# EAGLE design 5V AC TO DC (EAGLE 9.6.2)
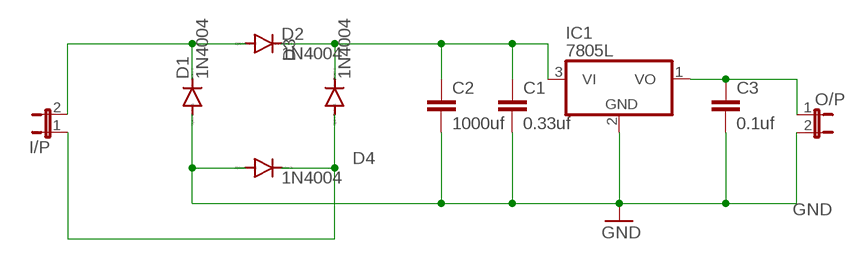
[diagram p0: schematic, sheet 1]

## Parts
C1  0.33uf  C2,5-3  [C2.5-3]
C2  1000uf  C2,5-3  [C2.5-3]
C3  0.1uf  C2,5-3  [C2.5-3]
D1  1N4004  [DO41-10]
D2  1N4004  [DO41-10]
D3  1N4004  [DO41-10]
D4  1N4004  [DO41-10]
I/P  JP1E  [JP1]
IC1  7805L  [TO92]
O/P  JP1E  [JP1]

## Nets
GND: C1.2 C2.2 C3.2 D1.A D4.A IC1.2(GND) O/P.2
N$1: D1.C D2.A I/P.2
N$2: C1.1 C2.1 D2.C D3.C IC1.3(VI)
N$3: C3.1 IC1.1(VO) O/P.1
N$5: D3.A D4.C I/P.1

## Library data of the parts
C1-C3 = capacitor-wima:C: CAPACITOR naming: grid - package width
D1-D4 = diode:1N4004: DIODE general purpose rectifier, 1 A
I/P O/P = jumper:JP1E: JUMPER
IC1 = linear:78*: Positive VOLTAGE REGULATOR Source: http://cache.national.com/ds/LM/LM78L05.pdf http://www.fairchildsemi.com/ds/LM/LM7805.pdf

## Board
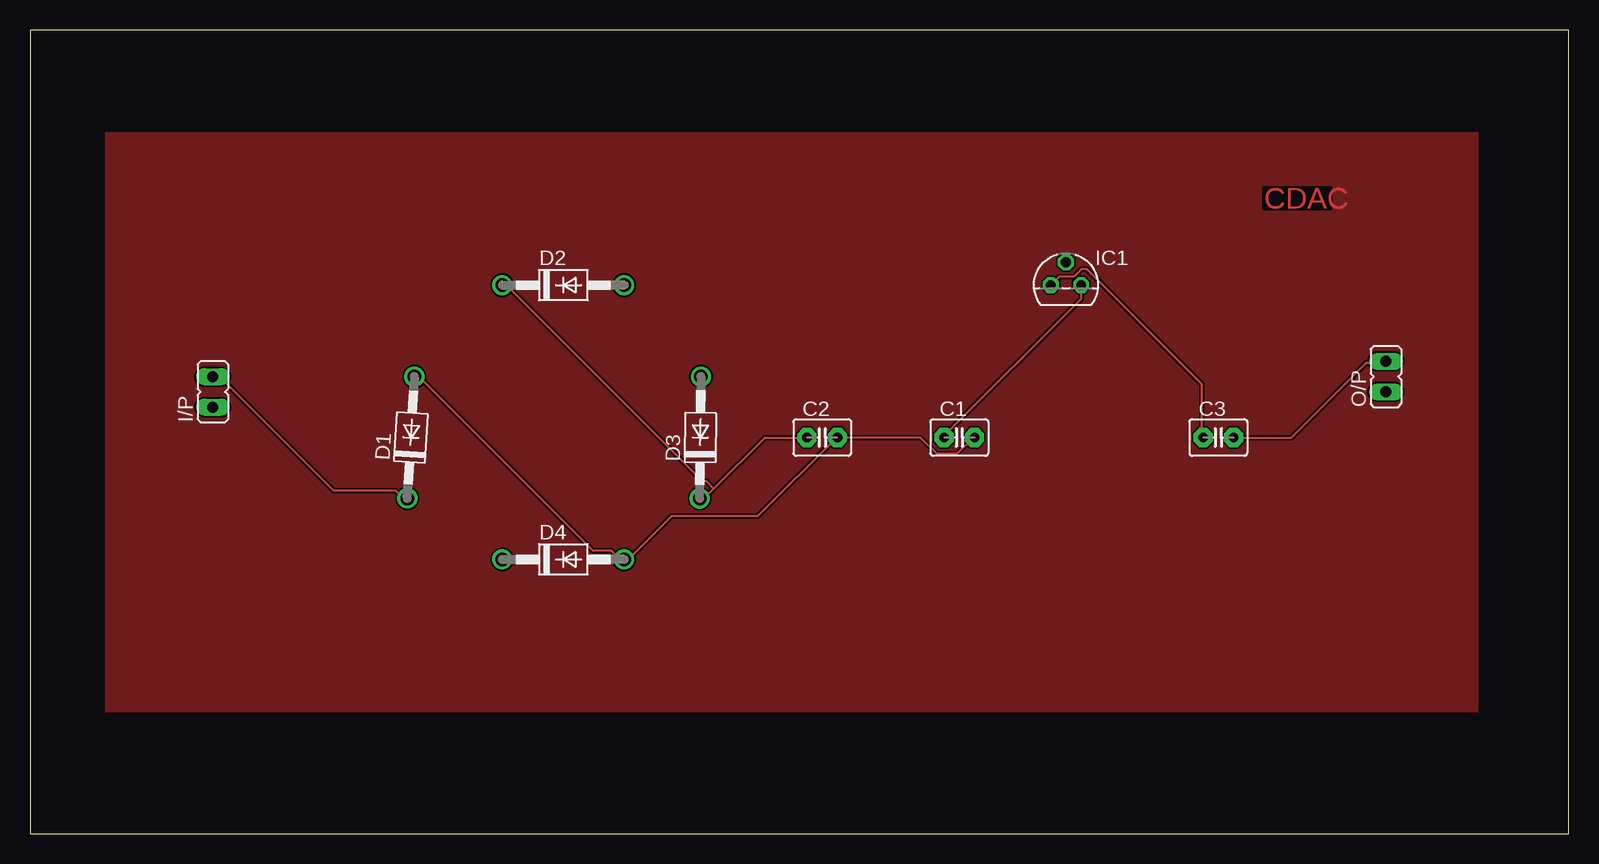
[diagram p1: board, top side]
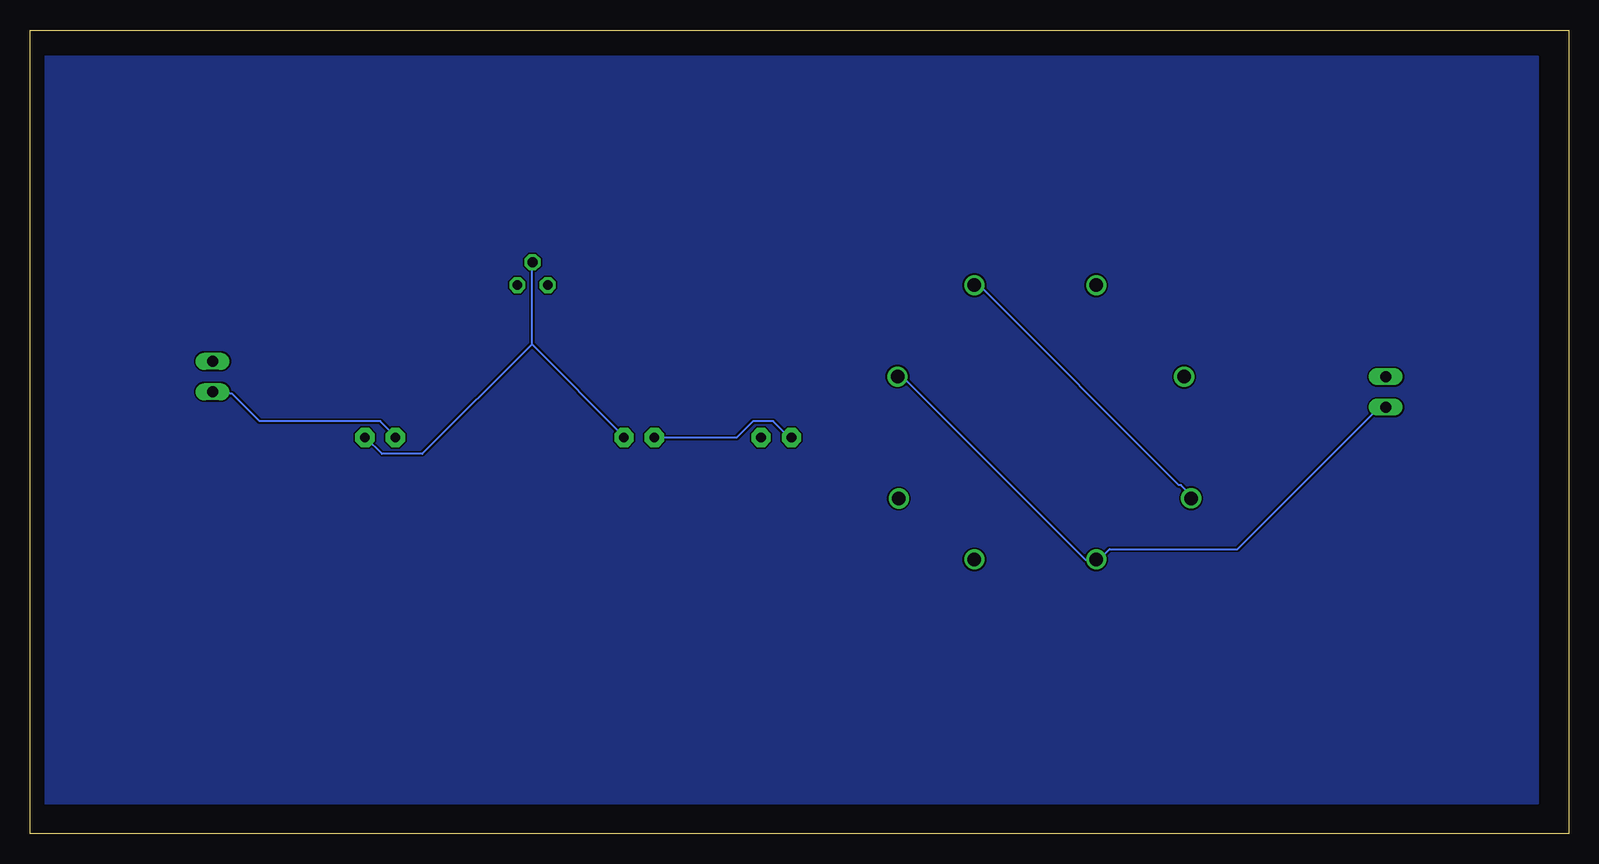
[diagram p2: board, bottom side, seen from below]

Size 128.25 x 66.98 mm. Coordinates in mm from the lower left corner, seen from the top.
Outline: 0,0 128.25,0 128.25,66.98 0,66.98 0,0
Copper layers (1*16): Top 0.035mm / dielectric 1.5mm / Bottom 0.035mm
Design rules "default": minimum track width 6mil, minimum drill 0.35mm, track to track 6mil, track to pad 6mil, pad to pad 6mil, via to via 6mil, smd to smd 6mil, copper to edge 40mil, drill to drill 6mil, minimum pad ring 10mil, minimum via ring 8mil, stop-mask expansion 4mil, vias tented up to drill 0mil, thermal gap 10mil

### Footprints (pad centres in the part's own frame; a part is rotated, then mirrored left to right if it is on the bottom)
C2.5-3 = drill 0.813 pad 1.6 octagon: 1 -1.27,0; 2 1.27,0
DO41-10 = drill 1.118: A 5.08,0; C -5.08,0
JP1 = drill 0.914 long: 1 0,-1.27; 2 0,1.27
TO92 = drill 0.813 octagon: 1 -1.27,0; 2 0,1.905; 3 1.27,0

### Placement (x,y rotation side)
C1  77.47,33.02 0 top
C2  66.04,33.02 0 top
C3  99.06,33.02 0 top
D1  31.75,33.02 86.7 top
D2  44.45,45.72 0 top
D3  55.88,33.02 89.4 top
D4  44.45,22.86 0 top
I/P  15.24,36.83 0 top
IC1  86.36,45.72 0 top
O/P  113.03,38.1 0 top

### Tracks (layer width: path | path; a pad name or v marks a point on that pad's centre or on a via)
BOTTOM
  pour Bottom: 2.54,64.77 127,64.77 127,2.54 2.54,2.54
GND
  Top 0.152: C3.2 105.16,33.02 111.4,39.27 112.93,39.27 O/P.2 | C1.2 78.64,33.02 77.27,31.65 75.59,31.65 74.22,33.02 C2.2 67.21,33.02 60.66,26.47 53.49,26.47 49.99,22.96 49.53,22.96 | 49.53,22.96 49.07,22.96 48.46,23.57 46.94,23.57 32.46,38.05 32.16,38.05 D1.A | 49.53,22.96 D4.A
  Bottom 0.152: 86.41,40.79 86.41,47.5 IC1.2 | 86.41,40.79 78.64,33.02 C1.2 | 86.41,40.79 95.56,31.65 98.91,31.65 100.28,33.02 C3.2
N$1
  Top 0.152: I/P.2 15.24,38.05 15.85,38.05 25.3,28.6 30.48,28.6 31.09,27.99 31.39,27.99 D1.C
  Bottom 0.152: D2.A 49.53,45.67 49.07,45.67 32.46,29.06 32.31,29.06 31.55,28.3 31.55,27.99 D1.C
N$2
  Top 0.152: IC1.3 87.63,44.6 76.2,33.17 C1.1 | C2.1 61.27,33.02 57,28.75 | 57,28.75 56.24,27.99 55.93,27.99 D3.C | 57,28.75 56.39,29.36 56.08,29.36 39.78,45.67 39.47,45.67 D2.C
  Bottom 0.152: C1.1 69.34,33.02 67.97,34.39 66.29,34.39 64.92,33.02 C2.1
N$3
  Top 0.152: IC1.1 85.8,46.43 87.02,46.43 87.63,47.04 88.09,47.04 97.69,37.44 97.69,33.02 C3.1
  Bottom 0.152: O/P.1 111.71,36.83 111.56,36.68 111.4,36.68 109.12,34.39 99.06,34.39 97.69,33.02 C3.1
N$5
  Bottom 0.152: I/P.1 15.24,35.46 15.85,35.46 27.58,23.72 38.25,23.72 39.01,22.96 39.32,22.96 D4.C 39.47,22.81 40.23,22.81 55.47,38.05 55.93,38.05 D3.A
TOP
  pour Top: 6.35,58.42 118.11,58.42 120.65,58.42 120.65,10.16 7.62,10.16 6.35,10.16

### Text on the board
Top: CDAC